# EAGLE design PowerSwitchV1 (EAGLE 9.4.2)
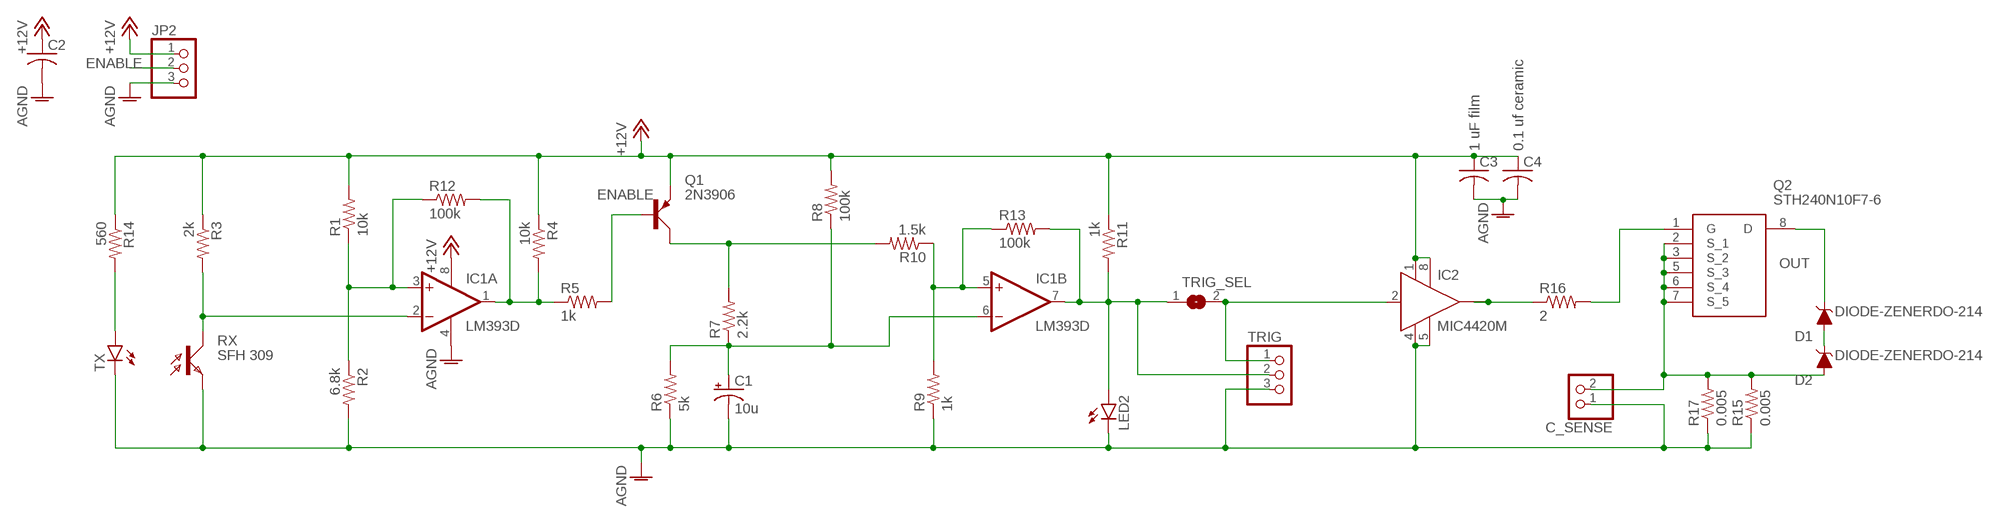
[diagram p0: schematic, sheet 1]

## Parts
C1  10u  CPOL-USTT2D6  [TT2D6]
C2  C-US050-050X075  [C050-050X075]
C3  1 uF film  C-US050-045X075  [C050-045X075]
C4  0.1 uf ceramic  C-US025-030X050  [C025-030X050]
C_SENSE  PINHD-1X2  [1X02]
D1  DIODE-ZENERDO-214  [SMA-DIODE]
D2  DIODE-ZENERDO-214  [SMA-DIODE]
IC1  LM393D  [SO08]
IC2  MIC4420M  [SO-08]
JP2  PINHD-1X3  [1X03]
LED2  LEDCHIPLED_0603  [CHIPLED_0603]
Q1  2N3906  [TO92D]
Q2  STH240N10F7-6  [H2PAK-6_1]
R1  10k  R-US_R0603  [R0603]
R2  6.8k  R-US_R0603  [R0603]
R3  2k  R-US_R0603  [R0603]
R4  10k  R-US_R0603  [R0603]
R5  1k  R-US_R0603  [R0603]
R6  5k  R-US_R0603  [R0603]
R7  2.2k  R-US_R0603  [R0603]
R8  100k  R-US_R0603  [R0603]
R9  1k  R-US_R0603  [R0603]
R10  1.5k  R-US_R0603  [R0603]
R11  1k  R-US_R0603  [R0603]
R12  100k  R-US_R0603  [R0603]
R13  100k  R-US_R0603  [R0603]
R14  560  R-US_R0603  [R0603]
R15  0.005  R-US_R1206  [R1206]
R16  2  R-US_M0805  [M0805]
R17  0.005  R-US_R1206  [R1206]
RX  SFH 309  BPX81  [BPX81]
TRIG  PINHD-1X3  [1X03]
TRIG_SEL  SJ  [SJ]
TX  LED3MM  [LED3MM]

## Nets
+12V: C2.1 C3.1 C4.1 IC1.8(P:V+) IC2.1(VS) IC2.8(VS1) JP2.1 Q1.E R1.2 R3.1 R4.1 R8.2 R11.1 R14.1
AGND: C1.- C2.2 C3.2 C4.2 C_SENSE.1 IC1.4(P:V-) IC2.4(GND) IC2.5(GND1) JP2.3 LED2.C R2.2 R6.1 R9.1 R15.1 R17.1 RX.E TRIG.3 TX.K(C)
ENABLE: JP2.2 Q1.B R5.2
N$1: IC1.2(A:-IN) R3.2 RX.C
N$2: IC2.2(IN) TRIG.1 TRIG_SEL.2
N$3: IC1.3(A:+IN) R1.1 R2.1 R12.1
N$4: IC2.6(OUT) IC2.7(OUT) R16.1
N$5: IC1.1(A:OUT) R4.2 R5.1 R12.2
N$7: Q1.C R7.2 R10.2
N$8: C1.+ IC1.6(B:-IN) R6.2 R7.1 R8.1
N$9: R14.2 TX.A
N$10: D1.A D2.C
N$11: IC1.5(B:+IN) R9.2 R10.1 R13.1
N$13: IC1.7(B:OUT) LED2.A R11.2 R13.2 TRIG.2 TRIG_SEL.1
N$14: C_SENSE.2 D2.A Q2.2(S_1) Q2.3(S_2) Q2.5(S_3) Q2.6(S_4) Q2.7(S_5) R15.2 R17.2
N$15: Q2.1(G) R16.2
OUT: D1.C Q2.8(D)

## Library data of the parts
C1 = rcl:CPOL-US: POLARIZED CAPACITOR, American symbol; SPICEPREFIX: C
C2-C4 = rcl:C-US: CAPACITOR, American symbol; SPICEPREFIX: C
C_SENSE = pinhead:PINHD-1X2: PIN HEADER
D1 D2 = sparkfun-discretesemi:DIODE-ZENER: Zener Diode A Zener diode allows current to flow from its anode to its cathode like a normal semiconductor diode, but it also permits current to flow in the reverse direction when its "Zener voltage" is reached. - WIkipedia
IC1 = linear:LM393: COMPARATOR
IC2 = transistor-power:MIC4420: 6A-Peak Low-Side MOSFET Driver Bipolar/CMOS/DMOS Process http://www.micrel.com/_PDF/mic4420.pdf
JP2 TRIG = pinhead:PINHD-1X3: PIN HEADER
LED2 TX = led:LED: LED OSRAM: - CHIPLED LG R971, LG N971, LY N971, LG Q971, LY Q971, LO R971, LY R971 LH N974, LH R974 LS Q976, LO Q976, LY Q976 LO Q996 - Hyper CHIPLED LW Q18S LB Q993, LB Q99A, LB R99A - SideLED LS A670, LO A670, LY A670, LG A670, LP A670 LB A673, LV A673, LT A673, LW A673 LH A674 LY A675 LS A676, LA A676, LO A676, LY A676, LW A676 LS A679, LY A679, LG A679 - Hyper Micro SIDELED® LS Y876, LA Y876, LO Y876, LY Y876 LT Y87S - SmartLED LW L88C, LW L88S LB L89C, LB L89S, LG L890 LS L89K, LO L89K, LY L89K LS L896, LA L896, LO L896, LY L896 - TOPLED LS T670, LO T670, LY T670, LG T670, LP T670 LSG T670, LSP T670, LSY T670, LOP T670, LYG T670 LG T671, LOG T671, LSG T671 LB T673, LV T673, LT T673, LW T673 LH T674 LS T676, LA T676, LO T676, LY T676, LB T676, LH T676, LSB T676, LW T676 LB T67C, LV T67C, LT T67C, LS T67K, LO T67K, LY T67K, LW E67C LS E67B, LA E67B, LO E67B, LY E67B, LB E67C, LV E67C, LT E67C LW T67C LS T679, LY T679, LG T679 LS T770, LO T770, LY T770, LG T770, LP T770 LB T773, LV T773, LT T773, LW T773 LH T774 LS E675, LA E675, LY E675, LS T675 LS T776, LA T776, LO T776, LY T776, LB T776 LHGB T686 LT T68C, LB T68C - Hyper Mini TOPLED® LB M676 - Mini TOPLED Santana® LG M470 LS M47K, LO M47K, LY M47K Source: http://www.osram.convergy.de LUXEON: - LUMILED® LXK2-PW12-R00, LXK2-PW12-S00, LXK2-PW14-U00, LXK2-PW14-V00 LXK2-PM12-R00, LXK2-PM12-S00, LXK2-PM14-U00 LXK2-PE12-Q00, LXK2-PE12-R00, LXK2-PE12-S00, LXK2-PE14-T00, LXK2-PE14-U00 LXK2-PB12-K00, LXK2-PB12-L00, LXK2-PB12-M00, LXK2-PB14-N00, LXK2-PB14-P00, LXK2-PB14-Q00 LXK2-PR12-L00, LXK2-PR12-M00, LXK2-PR14-Q00, LXK2-PR14-R00 LXK2-PD12-Q00, LXK2-PD12-R00, LXK2-PD12-S00 LXK2-PH12-R00, LXK2-PH12-S00 LXK2-PL12-P00, LXK2-PL12-Q00, LXK2-PL12-R00 Source: www.luxeon.com KINGBRIGHT: KA-3528ASYC Source: www.kingbright.com
Q1 = transistor-small-signal:2N3906: PNP TRANSISTOR
Q2 = STH240N10F7-6:STH240N10F7-6: N-channel 100 V, 0.002 typ., 180 A STripFET F7 Power MOSFETs in H2PAK-2 and H2PAK-6 packages Source: Datasheet <http://www.st.com/content/ccc/resource/technical/document/datasheet/c0/bb/6e/12/19/24/43/41/DM00111318.pdf/files/DM00111318.pdf/jcr:content/translations/en.DM00111318.pdf>; DESCRIPTION: N-channel 100 V, 0.002 typ., 180 A STripFET F7 Power MOSFETs in H2PAK-2 and H2PAK-6 packages; HEIGHT: mm; MANUFACTURER_NAME: STMicroelectronics; MANUFACTURER_PART_NUMBER: STH240N10F7-6; MOUSER_PART_NUMBER: 511-STH240N10F7-6; MOUSER_PRICE-STOCK: https://www.mouser.com/Search/Refine.aspx?Keyword=511-STH240N10F7-6
R1-R17 = rcl:R-US_: RESISTOR, American symbol; SPICEPREFIX: R
RX = opto-trans-siemens:BPX81: PHOTO TRANSISTOR; OC_FARNELL: unknown; OC_NEWARK: unknown
TRIG_SEL = jumper:SJ: SMD solder JUMPER

## Board
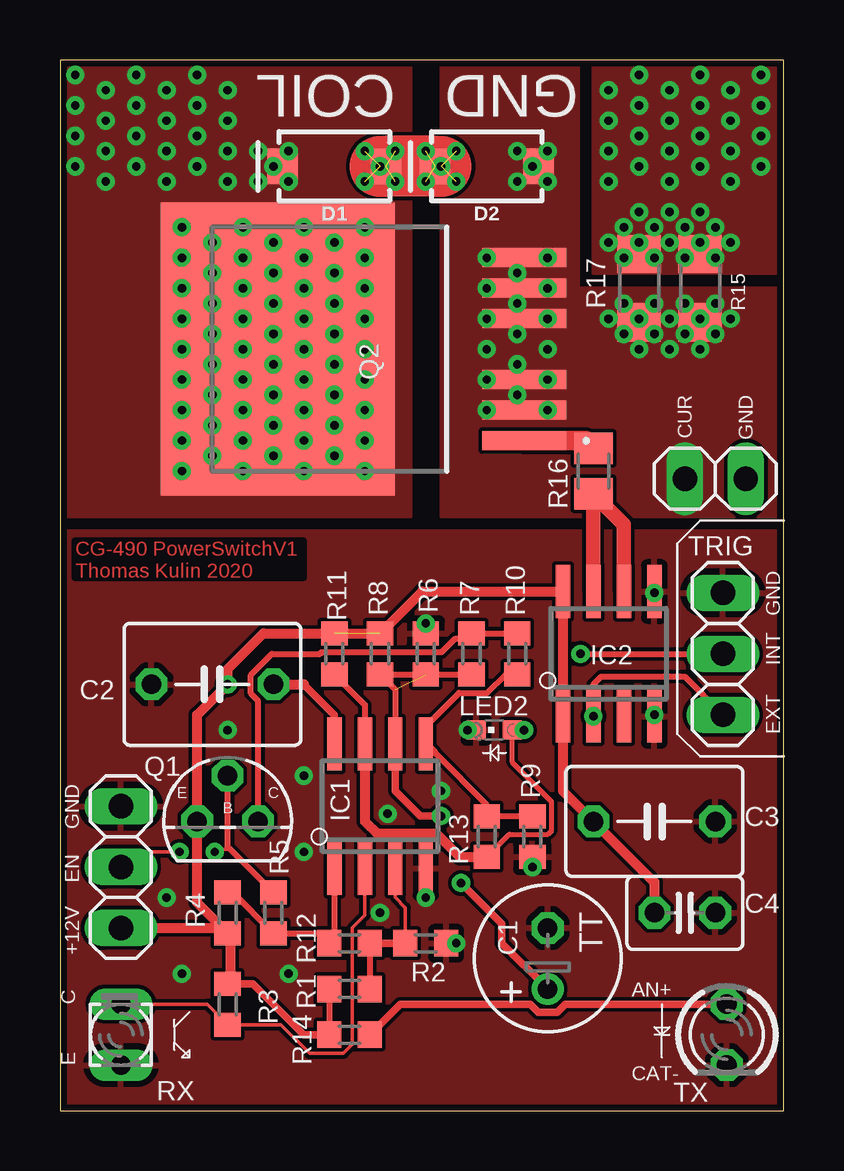
[diagram p1: board, top side]
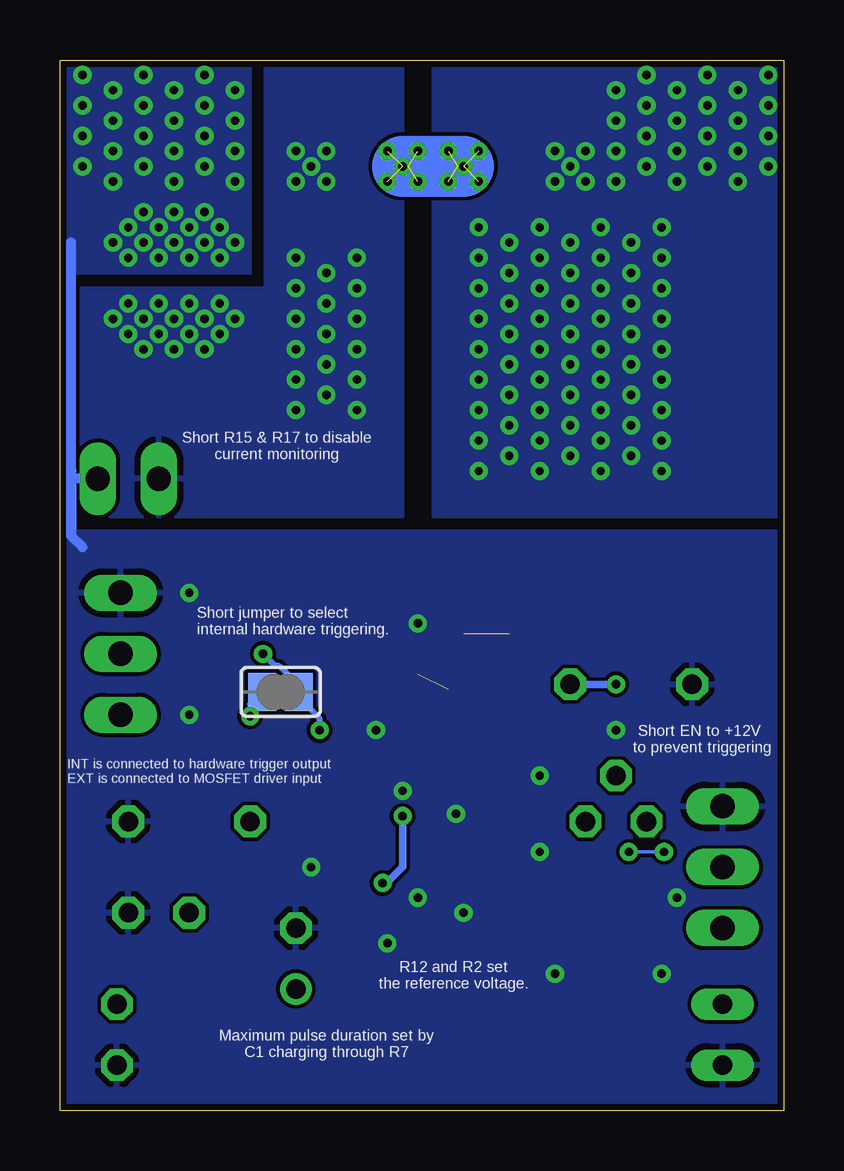
[diagram p2: board, bottom side, seen from below]

Size 30.15 x 43.8 mm. Coordinates in mm from the lower left corner, seen from the top.
Outline: 0,0 30.15,0 30.15,43.8 0,43.8 0,0
Copper layers (1*16): Top 0.035mm / dielectric 1.5mm / Bottom 0.035mm
Design rules "default *": minimum track width 6mil, minimum drill 0.35mm, track to track 6mil, track to pad 6mil, pad to pad 6mil, via to via 6mil, smd to smd 6mil, copper to edge 10mil, drill to drill 6mil, minimum pad ring 10mil, minimum via ring 8mil, stop-mask expansion 4mil, vias tented up to drill 0mil, thermal gap 10mil

### Footprints (pad centres in the part's own frame; a part is rotated, then mirrored left to right if it is on the bottom)
TT2D6 = drill 0.813: + -1.27,0 | drill 0.813 octagon: - 1.27,0
C050-050X075 = drill 0.813 octagon: 1 -2.54,0; 2 2.54,0
C050-045X075 = drill 0.813 octagon: 1 -2.54,0; 2 2.54,0
C025-030X050 = drill 0.813 octagon: 1 -1.27,0; 2 1.27,0
1X02 = drill 1.016 long: 1 -1.27,0; 2 1.27,0
SMA-DIODE = smd 1.27 x 1.47: A -2.15,0; C 2.15,0
SO08 = smd 0.6 x 2.2: 1 -1.905,-2.6; 2 -0.635,-2.6; 3 0.635,-2.6; 4 1.905,-2.6; 5 1.905,2.6; 6 0.635,2.6; 7 -0.635,2.6; 8 -1.905,2.6
SO-08 = smd 0.6 x 2.2: 1 -1.905,-2.6; 2 -0.635,-2.6; 3 0.635,-2.6; 4 1.905,-2.6; 5 1.905,2.6; 6 0.635,2.6; 7 -0.635,2.6; 8 -1.905,2.6
1X03 = drill 1.016 long: 1 -2.54,0; 2 0,0; 3 2.54,0
CHIPLED_0603 = smd 0.8 x 0.8: A 0,-0.75; C 0,0.75
TO92D = drill 0.813 octagon: B 0,1.905; C 1.27,0; E -1.27,0
H2PAK-6_1 = smd 0.8 x 3.5: 1 -3.81,-13; 2 -2.54,-13; 3 -1.27,-13; 5 1.27,-13; 6 2.54,-13; 7 3.81,-13 | smd 12.2 x 9.75: 8 0,-2.725
R0603 = smd 1 x 1.1: 1 -0.85,0; 2 0.85,0
R1206 = smd 1.6 x 1.803: 1 -1.422,0; 2 1.422,0
M0805 = smd 1.3 x 1.6: 1 -0.95,0; 2 0.95,0
BPX81 = drill 0.813 long: C 1.27,0; E -1.27,0
SJ = smd 1.168 x 1.6: 1 -0.762,0; 2 0.762,0
LED3MM = drill 0.813 octagon: A -1.27,0; K 1.27,0

### Placement (x,y rotation side)
C1  20.32,6.35 90 top
C2  6.35,17.78 180 top
C3  24.77,12.06 0 top
C4  26.04,8.26 0 top
C_SENSE  27.3,26.35 180 top
D1  11.43,39.37 180 top
D2  17.78,39.37 180 top
IC1  13.34,12.7 0 top
IC2  22.86,19.05 0 top
JP2  2.54,10.16 90 top
LED2  18.1,15.88 90 top
Q1  6.99,12.06 0 top
Q2  6.35,31.75 90 top
R1  12.06,5.08 180 top
R2  15.24,6.99 0 top
R3  6.99,4.45 270 top
R4  6.99,8.26 90 top
R5  8.89,8.26 90 top
R6  15.24,19.05 270 top
R7  17.14,19.05 90 top
R8  13.34,19.05 90 top
R9  19.68,11.43 90 top
R10  19.05,19.05 90 top
R11  11.43,19.05 270 top
R12  12.06,6.99 180 top
R13  17.78,11.43 270 top
R14  12.06,3.17 0 top
R15  26.67,34.29 270 top
R16  22.23,26.67 90 top
R17  24.13,34.29 270 top
RX  2.54,3.17 90 top
TRIG  27.62,19.05 90 top
TRIG_SEL  20.95,17.46 180 bottom
TX  27.78,3.17 270 top

### Tracks (layer width: path | path; a pad name or v marks a point on that pad's centre or on a via)
+12V  (via drill 0.35)  (1 unrouted)
  Top 0.254: 7.2,5.08 7.09,5.19 R3.1 | R1.2 R14.1
  Top 0.305: 11,5.29 R1.2 | R3.1 8.04,5.29 10.16,3.17 R14.1 | IC1.8 11.43,16.51 10.16,17.78
  Top 0.406: C2.1 10.16,17.78 | JP2.1 6.77,7.62 R4.1 | R4.1 5.71,8.68 Q1.E 5.71,16.51 v6.99,17.78 6.99,18.41 8.47,19.9 R8.2 15.09,21.65 IC2.8 IC2.1 20.95,13.34 C3.1 24.77,9.53 C4.1 | R4.1 7.09,7.41 7.09,5.19
  Bottom 0.305: v6.99,17.78 C2.1
AGND  (via drill 0.35)
  Bottom 0.406: 29.69,36.2 29.69,23.98 29.21,23.5 | C_SENSE.1 29.68,26.35 | 29.68,26.35 29.68,26.67 | 29.68,26.35 29.68,23.98
  other vias: 16.51,6.99 15.24,8.89 10.16,13.97 10.16,10.79 6.99,15.88 5.08,5.71 9.53,5.71 4.45,8.89 16.99,15.88 19.68,10.16 15.24,20.32 23.5,36.83 24.77,36.83 24.13,36.2 23.5,35.56 24.77,35.56 26.04,35.56 26.04,36.83 27.3,36.83 27.3,35.56 26.67,36.2 29.21,43.18 26.67,43.18 24.13,43.18 24.13,41.91 26.67,41.91 29.21,41.91 27.94,42.55 25.4,42.55 25.4,41.27 27.94,41.27 24.13,40.64 26.67,40.64 29.21,40.64 27.94,40.01 25.4,40.01 24.13,39.37 26.67,39.37 29.21,39.37 25.4,38.73 27.94,38.73 22.86,42.55 22.86,41.27 22.86,40.01 22.86,38.73 15.88,13.34 13.65,12.38 13.34,8.26 22.86,36.2 25.4,36.2 24.13,37.47 25.4,37.47 26.67,37.47 27.94,36.2 24.77,16.51 24.77,21.59
  pour Top: 0,-0.64 0,24.13 30.48,24.13 30.48,-0.64
  pour Bottom: 0,24.13 30.48,24.13 30.48,0 0,0
  pour Top (no thermals): 22.23,43.18 22.23,34.92 30.48,34.92 30.48,43.81 22.23,43.81
  pour Bottom (no thermals): 22.23,43.81 22.23,34.92 30.48,34.92 30.48,43.81
ENABLE  (via drill 0.35)
  Top 0.152: JP2.2 3.17,10.79 v4.98,10.79 | v6.45,10.79 6.56,10.9 7.09,10.9
  Top 0.254: R5.2 7.09,10.9 6.99,11.01 Q1.B
  Bottom 0.152: v4.98,10.79 v6.45,10.79
N$1
  Top 0.152: IC1.2 12.7,8.14 12.19,7.63 12.19,2.77 11.81,2.4 10.4,2.4 9.2,3.6 R3.2 6.13,4.45 RX.C
N$2  (via drill 0.35)
  Top 0.254: v22.23,16.45 22.23,17.78 22.54,18.1 26.04,18.1 TRIG.1
  Bottom 0.254: TRIG_SEL.2 22.23,16.95 v22.23,16.45
N$3
  Top 0.152: R2.1 14.39,8.47 13.97,8.89 IC1.3
  Top 0.254: R12.1 R1.1
  Top 0.305: R12.1 R2.1
N$4
  Top 0.61: IC2.7 R16.1 23.5,24.45 IC2.6
N$5
  Top 0.254: R4.2 7.19,9.11 R5.1 10.79,7.41 R12.2 11.43,7.2 IC1.1
N$7
  Top 0.254: R10.2 R7.2 17.14,19.68 16.47,19.68 15.91,19.12 10.9,19.12 10.84,19.05 8.83,19.05 7.95,18.17 7.95,17.39 8.26,17.09 Q1.C
N$8  (via drill 0.35)  (1 unrouted)
  Top 0.254: IC1.6 13.97,17.57 R8.1 R7.1
  Top 0.305: IC1.6 13.97,13.34 15.02,12.29 v15.88,12.29 | C1.+ 18.41,6.99 18.41,7.79 v16.71,9.5
  Bottom 0.305: v15.88,12.29 15.88,10.16 16.54,9.5 v16.71,9.5
N$9
  Top 0.305: R14.2 14.19,4.45 19.59,4.45 19.92,4.12 20.72,4.12 21.05,4.45 TX.A
N$10  (via drill 0.35)  (8 unrouted)
  Top 2.54: v15.88,39.37 D2.C D1.A v13.34,39.37
  Bottom 2.54: v15.88,39.37 v13.34,39.37
  other vias: 12.7,40.01 12.7,38.73 13.97,40.01 13.97,38.73 15.24,40.01 16.51,40.01 16.51,38.73 15.24,38.73
N$11
  Top 0.254: R9.2 R13.1 17.78,12.76 15.67,14.87 15.4,15.14 | IC1.5 15.4,15.14 | 15.4,15.14 15.4,16.19 16.63,17.42 17.81,17.42 18.59,18.2 R10.1
  Top 0.305: 15.59,14.95 IC1.5
N$13  (via drill 0.35)
  Top 0.203: R13.2 18.73,11.53 20.34,11.53 20.49,11.68 20.49,12.88 18.85,14.53 LED2.A
  Top 0.254: R11.2 12.7,16.93 IC1.7 12.7,14.61 | LED2.A v19.33,15.88 | v21.69,19.05 TRIG.2
  Top 0.406: IC1.7 12.7,12.06 13.21,11.56 15.69,11.56 16.66,10.58 R13.2
  Bottom 0.254: v19.33,15.88 19.33,16.35 20.19,17.21 TRIG_SEL.1 20.19,17.72 21.02,18.54 21.18,18.54 v21.69,19.05
N$14  (via drill 0.35)
  other vias: 17.78,35.56 20.32,35.56 17.78,34.29 17.78,33.02 17.78,31.75 17.78,30.48 17.78,29.21 20.32,29.21 20.32,30.48 20.32,31.75 20.32,33.02 20.32,34.29 19.05,34.92 19.05,33.66 19.05,32.38 19.05,31.11 19.05,29.84 24.13,33.02 23.5,33.66 24.77,33.66 23.5,32.38 24.77,32.38 26.67,33.02 26.04,33.66 27.3,33.66 27.3,32.38 26.04,32.38 19.05,38.73 19.05,40.01 19.68,39.37 20.32,40.01 20.32,38.73 24.13,31.75 25.4,33.02 22.86,33.02 25.4,31.75 26.67,31.75 27.94,33.02
  pour Top (no thermals): 29.84,34.29 30.48,34.29 30.48,24.77 15.88,24.77 15.88,43.81 21.59,43.81 21.59,34.29
  pour Bottom: 15.88,43.81 21.59,43.81 21.59,34.29 30.48,34.29 30.48,24.77 15.88,24.77
N$15
  Top 0.406: 20.95,27.94 Q2.1
  Top 0.813: Q2.1 21.91,27.94 R16.2
OUT  (via drill 0.35)
  other vias: 5.08,36.83 6.35,36.2 7.62,36.83 10.16,36.83 12.7,36.83 8.89,36.2 11.43,36.2 5.08,35.56 7.62,35.56 10.16,35.56 12.7,35.56 12.7,34.29 10.16,34.29 7.62,34.29 5.08,34.29 5.08,33.02 5.08,31.75 5.08,30.48 5.08,29.21 5.08,27.94 5.08,26.67 7.62,26.67 7.62,27.94 7.62,29.21 7.62,30.48 7.62,31.75 7.62,33.02 10.16,33.02 10.16,31.75 10.16,30.48 10.16,29.21 10.16,27.94 10.16,26.67 12.7,26.67 12.7,27.94 12.7,29.21 12.7,30.48 12.7,31.75 12.7,33.02 11.43,34.92 11.43,33.66 11.43,32.38 11.43,31.11 11.43,29.84 11.43,28.57 11.43,27.3 8.89,27.3 8.89,28.57 8.89,29.84 8.89,31.11 8.89,32.38 8.89,33.66 8.89,34.92 6.35,34.92 6.35,33.66 6.35,32.38 6.35,31.11 6.35,29.84 6.35,28.57 6.35,27.3 8.26,40.01 8.89,39.37 9.53,40.01 9.53,38.73 8.26,38.73 0.64,43.18 3.17,43.18 5.71,43.18 6.99,42.55 4.45,42.55 1.91,42.55 5.71,41.91 3.17,41.91 0.64,41.91 1.91,41.27 4.45,41.27 6.99,41.27 0.64,40.64 3.17,40.64 5.71,40.64 1.91,40.01 4.45,40.01 6.99,40.01 0.64,39.37 3.17,39.37 5.71,39.37 6.99,38.73 4.45,38.73 1.91,38.73
  pour Top (no thermals): 0,43.81 14.61,43.81 14.61,24.77 0,24.77
  pour Bottom: 0,24.77 0,43.81 14.61,43.81 14.61,24.77

### Text on the board
Top: CG-490 PowerSwitchV1 / Thomas Kulin 2020
tPlace: COIL | GND | E | C | B
tNames: CUR | GND | TRIG | GND | INT | EXT | GND | IC1 | EN | +12V | AN+ | C | E | CAT-
bNames: Short R15 & R17 to disable / current monitoring | Short jumper to select / internal hardware triggering. | Short EN to +12V / to prevent triggering | INT is connected to hardware trigger output / EXT is connected to MOSFET driver input | R12 and R2 set / the reference voltage. | Maximum pulse duration set by / C1 charging through R7